# Altium schematic sheet FPGA_IO_1.SchDoc
size A
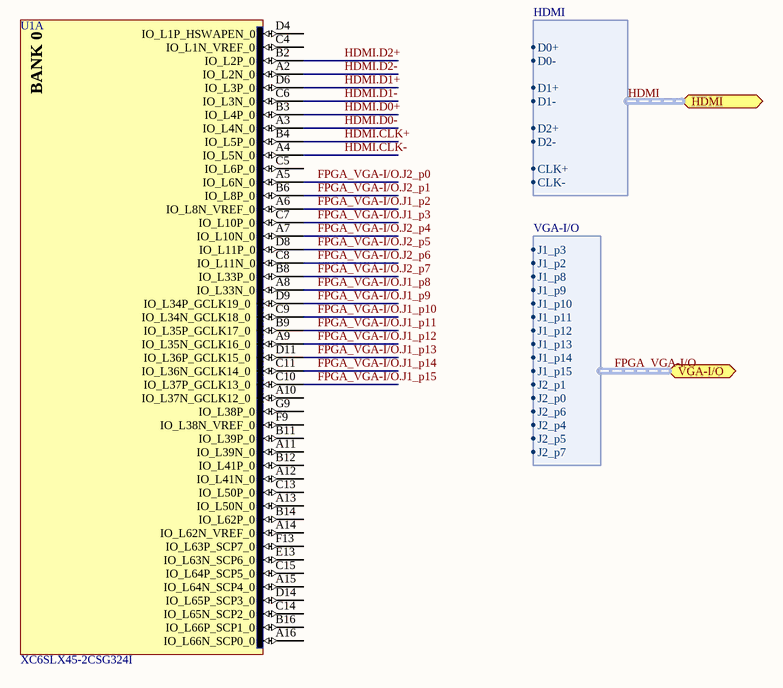
[diagram p0: FPGA_IO_1.SchDoc]

## Parts
U1  XC6SLX45-2CSG324I  [CSG324]  (part A of 8)

## Ports
HDMI (harness HDMI), VGA-I/O (harness VGA-I/O)

## Harnesses
HDMI: D0+, D0-, D1+, D1-, D2+, D2-, CLK+, CLK-
VGA-I/O: J2_p7, J2_p5, J2_p4, J2_p6, J2_p0, J2_p1, J1_p15, J1_p14, J1_p13, J1_p12, J1_p11, J1_p10, J1_p9, J1_p8, J1_p2, J1_p3

## Nets
FPGA_VGA-I/O.J1_p2: U1.A6(IO_L8N_VREF_0)
FPGA_VGA-I/O.J1_p3: U1.C7(IO_L10P_0)
FPGA_VGA-I/O.J1_p8: U1.A8(IO_L33N_0)
FPGA_VGA-I/O.J1_p9: U1.D9(IO_L34P_GCLK19_0)
FPGA_VGA-I/O.J1_p10: U1.C9(IO_L34N_GCLK18_0)
FPGA_VGA-I/O.J1_p11: U1.B9(IO_L35P_GCLK17_0)
FPGA_VGA-I/O.J1_p12: U1.A9(IO_L35N_GCLK16_0)
FPGA_VGA-I/O.J1_p13: U1.D11(IO_L36P_GCLK15_0)
FPGA_VGA-I/O.J1_p14: U1.C11(IO_L36N_GCLK14_0)
FPGA_VGA-I/O.J1_p15: U1.C10(IO_L37P_GCLK13_0)
FPGA_VGA-I/O.J2_p0: U1.A5(IO_L6N_0)
FPGA_VGA-I/O.J2_p1: U1.B6(IO_L8P_0)
FPGA_VGA-I/O.J2_p4: U1.A7(IO_L10N_0)
FPGA_VGA-I/O.J2_p5: U1.D8(IO_L11P_0)
FPGA_VGA-I/O.J2_p6: U1.C8(IO_L11N_0)
FPGA_VGA-I/O.J2_p7: U1.B8(IO_L33P_0)
HDMI.CLK+: U1.B4(IO_L5P_0)
HDMI.CLK-: U1.A4(IO_L5N_0)
HDMI.D0+: U1.B3(IO_L4P_0)
HDMI.D0-: U1.A3(IO_L4N_0)
HDMI.D1+: U1.D6(IO_L3P_0)
HDMI.D1-: U1.C6(IO_L3N_0)
HDMI.D2+: U1.B2(IO_L2P_0)
HDMI.D2-: U1.A2(IO_L2N_0)

Not connected (* = marked no-connect by the designer): U1 A10(IO_L37N_GCLK12_0) A11(IO_L39N_0) A12(IO_L41N_0) A13(IO_L50N_0) A14(IO_L62N_VREF_0) A15(IO_L64N_SCP4_0) A16(IO_L66N_SCP0_0) B11(IO_L39P_0) B12(IO_L41P_0) B14(IO_L62P_0) B16(IO_L66P_SCP1_0) C4(IO_L1N_VREF_0) C5(IO_L6P_0) C13(IO_L50P_0) C14(IO_L65N_SCP2_0) C15(IO_L64P_SCP5_0) D4(IO_L1P_HSWAPEN_0) D14(IO_L65P_SCP3_0) E13(IO_L63N_SCP6_0) F9(IO_L38N_VREF_0) F13(IO_L63P_SCP7_0) G9(IO_L38P_0)

## Buses and harness runs
harness FPGA_VGA-I/O = port VGA-I/O
harness HDMI = port HDMI

## Notes on the sheet
- (in symbol CMP-0067-00402-1, part A) BANK 0

## Library data of the parts
U1 = CMP-0067-00402-1: Spartan-6 LX 1.2V FPGA, 218 User I/Os, 324-Ball Chip-Scale BGA (0.8mm Pitch), Speed Grade 2, Industrial Grade, Pb-Free; Code_JEDEC: MO-275-KKAC-1; PackageDescription: 324-Ball Chip-Scale BGA (CSG324) Package, 0.8 mm Pitch; DatasheetVersion: ver1.6, Nov-2010; PackageVersion: ver1.1, Nov-2009; PackageReference: CSG324